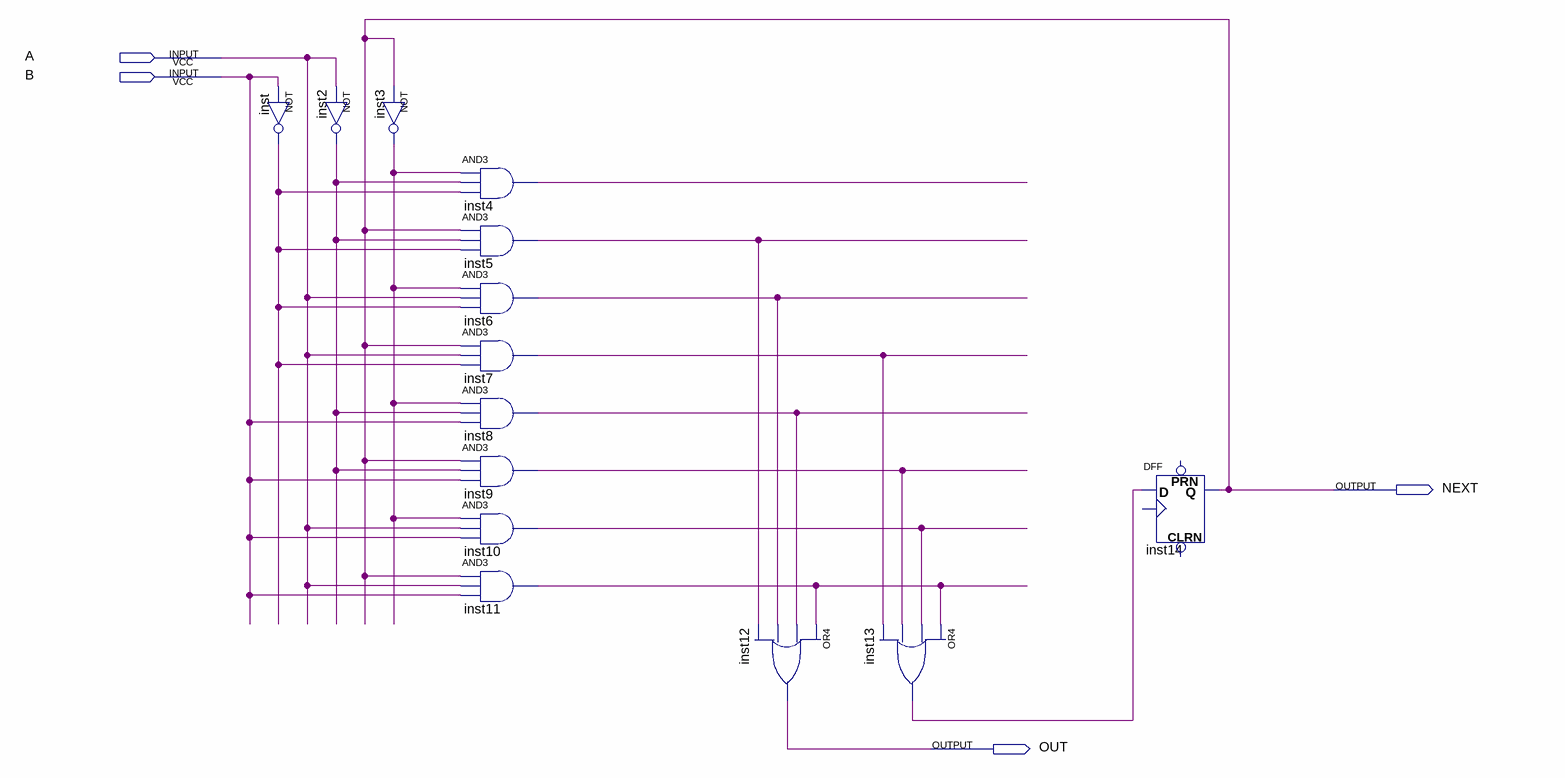
[diagram p0: schematic sheet]
// Quartus schematic problem3.bdf as structural Verilog: 14 symbols, 4 pins
module problem3 (
  input  A,
  input  B,
  output NEXT,
  output OUT
);

  wire inst2_out, inst3_out, inst4_out, inst5_out, inst6_out, inst7_out, inst8_out, inst9_out, inst10_out,
       inst11_out, inst13_out, inst_out;

  not inst (inst_out, B);
  not inst2 (inst2_out, A);
  not inst3 (inst3_out, NEXT);
  and inst4 (inst4_out, inst3_out, inst2_out, inst_out);
  and inst5 (inst5_out, NEXT, inst2_out, inst_out);
  and inst6 (inst6_out, inst3_out, A, inst_out);
  and inst7 (inst7_out, NEXT, A, inst_out);
  and inst8 (inst8_out, inst3_out, inst2_out, B);
  and inst9 (inst9_out, NEXT, inst2_out, B);
  and inst10 (inst10_out, inst3_out, A, B);
  and inst11 (inst11_out, NEXT, A, B);
  or inst12 (OUT, inst11_out, inst8_out, inst6_out, inst5_out);
  or inst13 (inst13_out, inst11_out, inst10_out, inst9_out, inst7_out);
  DFF inst14 (.D(inst13_out), .Q(NEXT));  // open: CLRN, CLK, PRN
endmodule
